# EAGLE design pcb_adc (EAGLE 7.4.0)
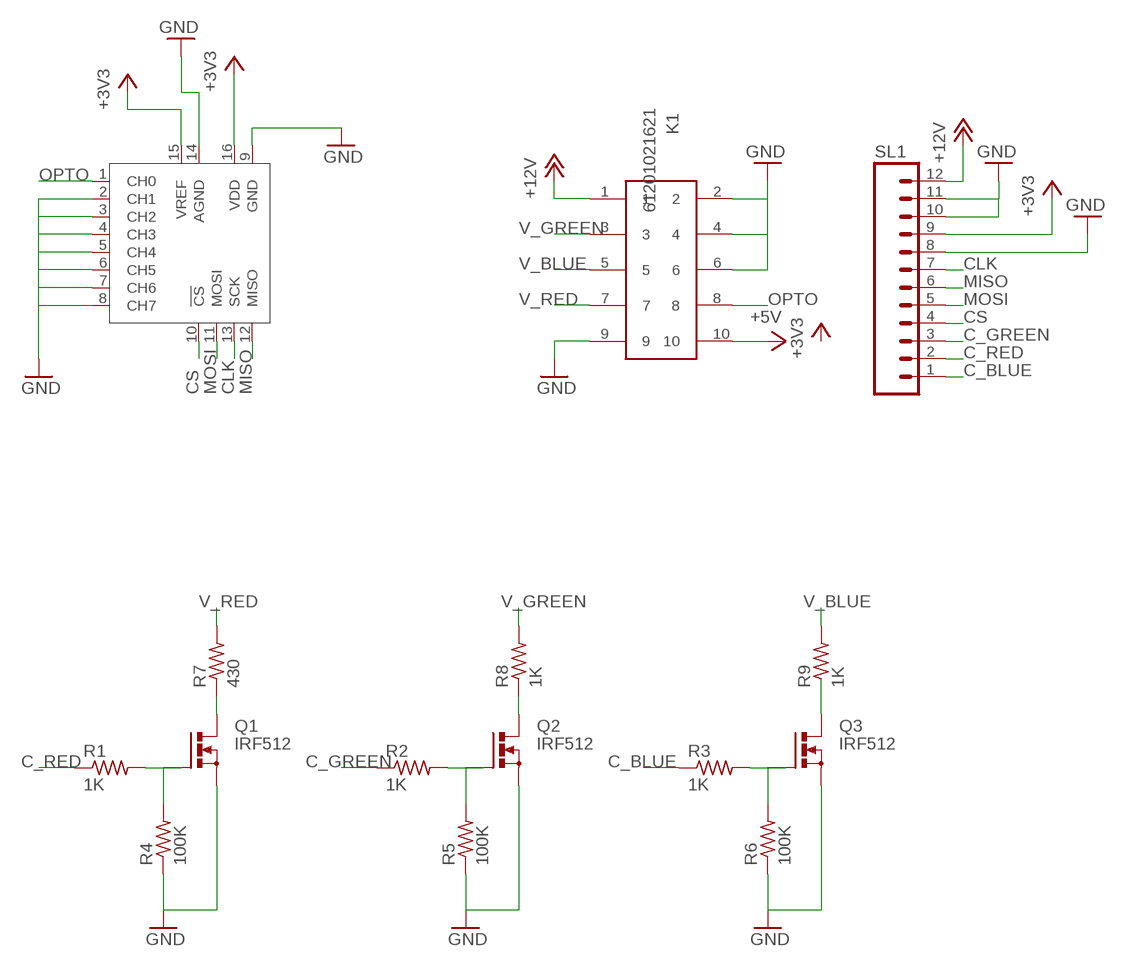
[diagram p0: schematic, sheet 1]

## Parts
K1  61201021621  [61201021621]
Q1  IRF512  [TO220BV]
Q2  IRF512  [TO220BV]
Q3  IRF512  [TO220BV]
R1  1K  R-US_0204/7  [0204/7]
R2  1K  R-US_0204/7  [0204/7]
R3  1K  R-US_0204/7  [0204/7]
R4  100K  R-US_0204/7  [0204/7]
R5  100K  R-US_0204/7  [0204/7]
R6  100K  R-US_0204/7  [0204/7]
R7  430  R-US_0204/7  [0204/7]
R8  1K  R-US_0204/7  [0204/7]
R9  1K  R-US_0204/7  [0204/7]
SL1  M12  [12P]
U$1  MCP3008P  [DIL16]

## Nets
+3V3: SL1.9 U$1.15(VREF) U$1.16(VDD)
+5V: K1.10
+12V: K1.1 SL1.12
C_BLUE: R3.1 SL1.1
C_GREEN: R2.1 SL1.3
C_RED: R1.1 SL1.2
CLK: SL1.7 U$1.13(SCK)
CS: SL1.4 U$1.10(!CS)
GND: K1.2 K1.4 K1.6 K1.9 Q1.S Q2.S Q3.S R4.1 R5.1 R6.1 SL1.8 SL1.10 SL1.11 U$1.2(CH1) U$1.3(CH2) U$1.4(CH3) U$1.5(CH4) U$1.6(CH5) U$1.7(CH6) U$1.8(CH7) U$1.9(GND) U$1.14(AGND)
MISO: SL1.6 U$1.12(MISO)
MOSI: SL1.5 U$1.11(MOSI)
N$1: Q1.G R1.2 R4.2
N$2: Q2.G R2.2 R5.2
N$3: Q3.G R3.2 R6.2
N$4: Q1.D R7.1
N$5: Q2.D R8.1
N$8: Q3.D R9.1
OPTO: K1.8 U$1.1(CH0)
V_BLUE: K1.5 R9.2
V_GREEN: K1.3 R8.2
V_RED: K1.7 R7.2

## Library data of the parts
K1 = Wurth_Elektronik_Electromechanic_Wire_to_Board_Connectors_rev15c:61201021621: WR-BHD 2.54mm Male Box Header, 10 Pins=>Code : Con_WTB_BHD_2.54_Male_THT_WS_61201021621 <http://katalog.we-online.de/media/thumbs2/eican/thb_Con_WTB_BHD_2.54_Male_THT_WS_6120xx21621_pf2.jpg> Details see: http://katalog.we-online.de/en/em/612_0xx_216_21 Created 2014-06-04, Karrer Zheng 2014 (C) Würth Elektronik
Q1-Q3 = transistor-power:IRF512: N-CHANNEL MOS FET
R1-R9 = resistor:R-US_: RESISTOR, American symbol
SL1 = con-amp-quick:M12: AMP QUICK CONNECTOR; OC_FARNELL: unknown; OC_NEWARK: unknown
U$1 = MCP3008:MCP3008

## Board
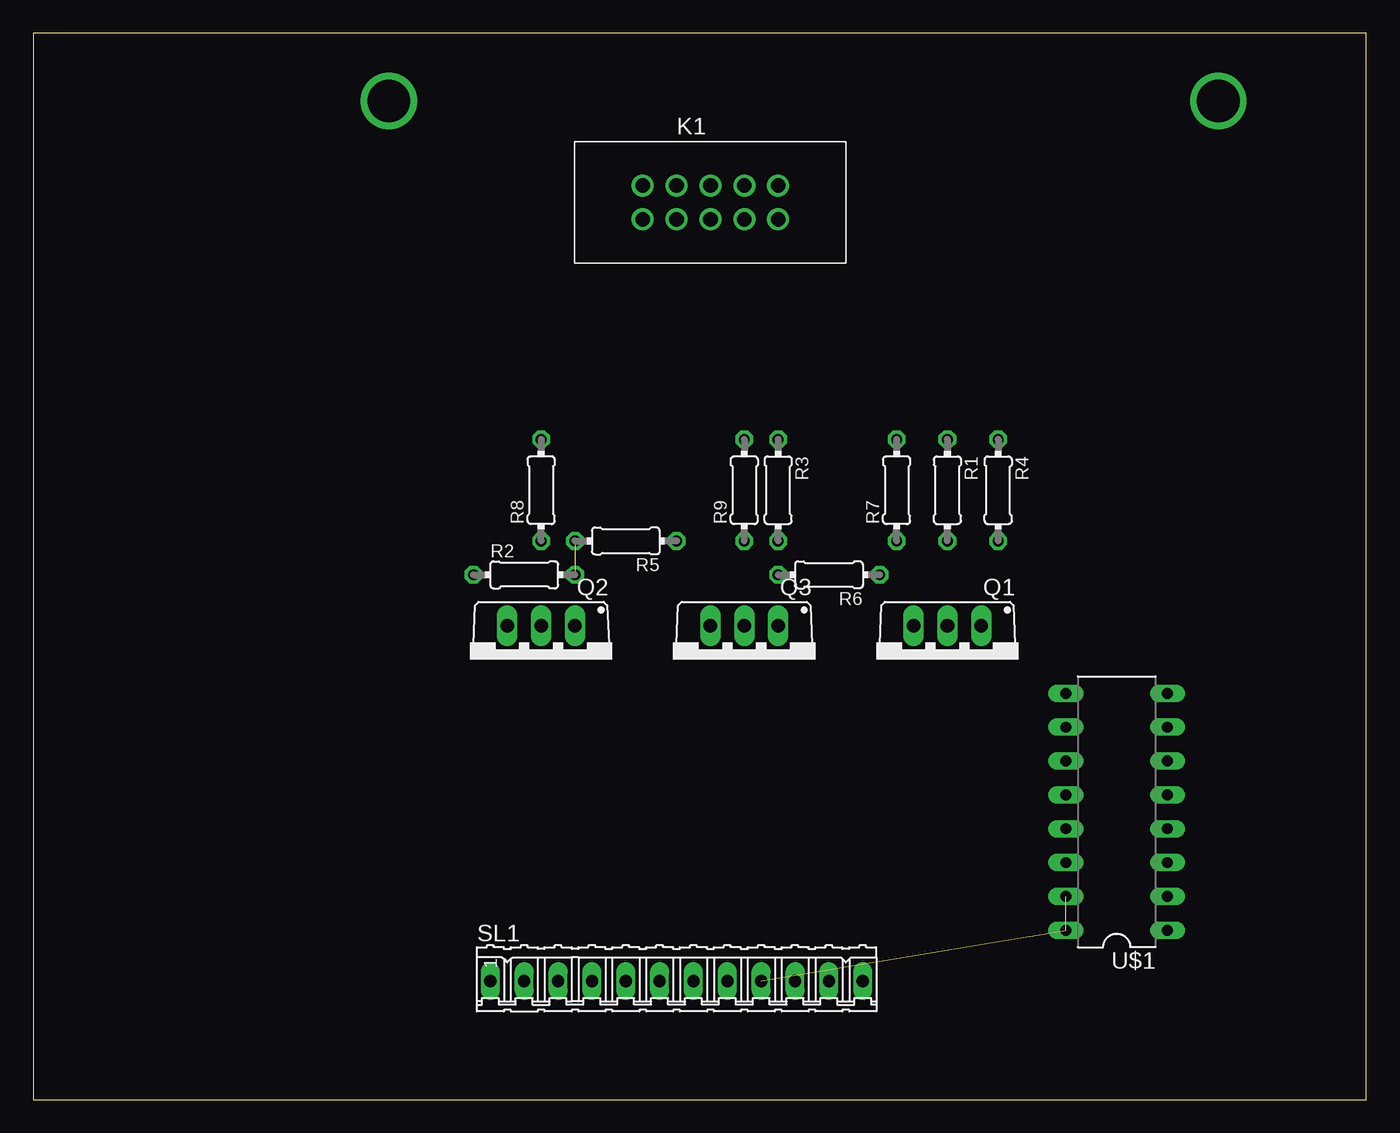
[diagram p1: board, top side]
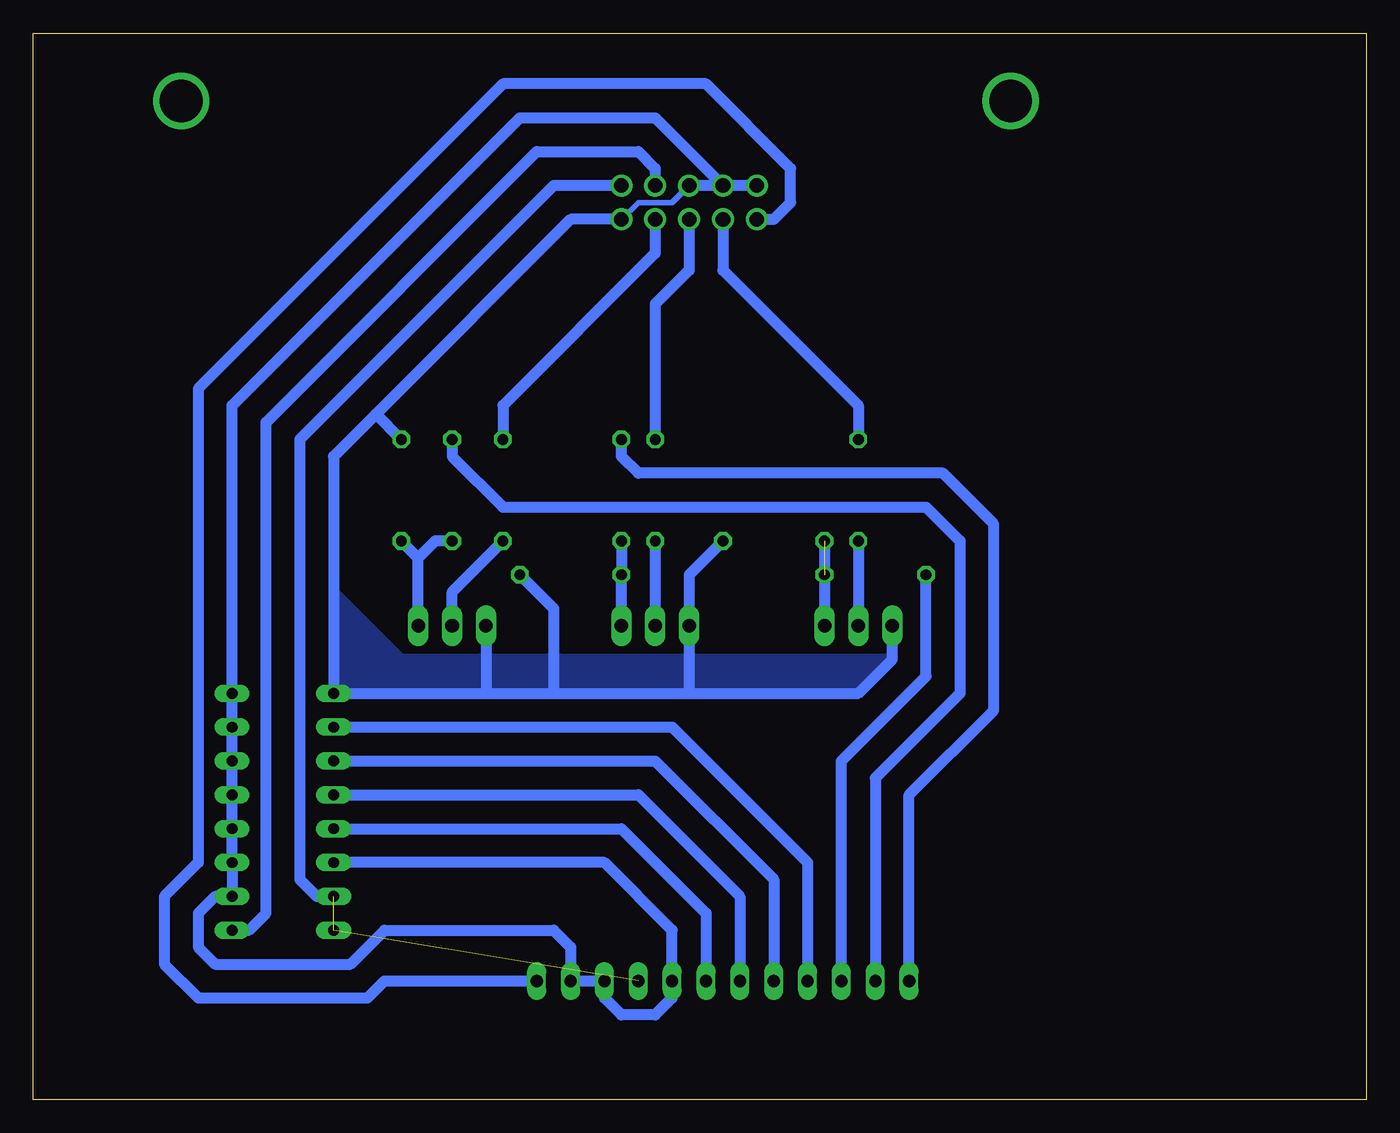
[diagram p2: board, bottom side, seen from below]

Size 100 x 80 mm. Coordinates in mm from the lower left corner, seen from the top.
Outline: 0,0 100,0 100,80 0,80 0,0
Copper layers (1*16): Top 0.035mm / dielectric 1.5mm / Bottom 0.035mm
Design rules "default": minimum track width 10mil, minimum drill 24mil, track to track 8mil, track to pad 8mil, pad to pad 8mil, via to via 8mil, smd to smd 8mil, copper to edge 40mil, drill to drill 8mil, minimum pad ring 10mil, minimum via ring 8mil, stop-mask expansion 4mil, vias tented up to drill 0mil, thermal gap 10mil

### Footprints (pad centres in the part's own frame; a part is rotated, then mirrored left to right if it is on the bottom)
61201021621 = drill 1.1: 1 -2.54,-1.27; 2 -2.54,1.27; 3 0,-1.27; 4 0,1.27; 5 2.54,-1.27; 6 2.54,1.27; 7 5.08,-1.27; 8 5.08,1.27; 9 7.62,-1.27; 10 7.62,1.27
TO220BV = drill 1.016 long: D 0,-2.54; G -2.54,-2.54; S 2.54,-2.54
0204/7 = drill 0.813 octagon: 1 -3.81,0; 2 3.81,0
12P = drill 0.914 long: 1 -13.97,0; 2 -11.43,0; 3 -8.89,0; 4 -6.35,0; 5 -3.81,0; 6 -1.27,0; 7 1.27,0; 8 3.81,0; 9 6.35,0; 10 8.89,0; 11 11.43,0; 12 13.97,0
DIL16 = drill 0.813 long: 1 -8.89,-3.81; 2 -6.35,-3.81; 3 -3.81,-3.81; 4 -1.27,-3.81; 5 1.27,-3.81; 6 3.81,-3.81; 7 6.35,-3.81; 8 8.89,-3.81; 9 8.89,3.81; 10 6.35,3.81; 11 3.81,3.81; 12 1.27,3.81; 13 -1.27,3.81; 14 -3.81,3.81; 15 -6.35,3.81; 16 -8.89,3.81

### Placement (x,y rotation side)
K1  48.26,67.31 0 top
Q1  68.58,33.02 180 top
Q2  38.1,33.02 180 top
Q3  53.34,33.02 180 top
R1  68.58,45.72 270 top
R2  36.83,39.37 0 top
R3  55.88,45.72 270 top
R4  72.39,45.72 270 top
R5  44.45,41.91 180 top
R6  59.69,39.37 180 top
R7  64.77,45.72 90 top
R8  38.1,45.72 90 top
R9  53.34,45.72 90 top
SL1  48.26,8.89 0 top
U$1  81.28,21.59 90 top

### Tracks (layer width: path | path; a pad name or v marks a point on that pad's centre or on a via)
+3V3  (2 unrouted)
+5V
  Bottom 0.813: K1.10 60.96,68.58 80.01,49.53 80.01,16.51 78.74,15.24
+12V
  Bottom 0.813: K1.1 44.45,66.04 43.18,67.31 43.18,69.85 49.53,76.2 64.77,76.2 87.63,53.34 87.63,17.78 90.17,15.24 90.17,10.16 87.63,7.62 74.93,7.62 73.66,8.89 SL1.12
C_BLUE
  Bottom 0.813: SL1.1 34.29,22.86 27.94,29.21 27.94,43.18 31.75,46.99 54.61,46.99 55.88,48.26 R3.1
C_GREEN
  Bottom 0.813: SL1.3 39.37,25.4 33.02,31.75 R2.1
C_RED
  Bottom 0.813: SL1.2 36.83,24.13 30.48,30.48 30.48,41.91 33.02,44.45 64.77,44.45 68.58,48.26 R1.1
CLK
  Bottom 0.813: U$1.13 55.88,20.32 49.53,13.97 SL1.7
CS
  Bottom 0.813: U$1.10 52.07,27.94 41.91,17.78 SL1.4
GND
  Bottom 0.254: 59.66,8.91 SL1.11
  Bottom 0.406: K1.6 52.07,67.31 54.61,67.31 K1.9
  Bottom 0.813: K1.2 K1.4 | K1.4 K1.6 | 59.66,8.91 59.64,8.89 SL1.10 57.15,7.62 55.88,6.35 53.34,6.35 52.07,7.62 SL1.8 52.07,12.7 57.15,17.78 U$1.14 | SL1.11 59.69,11.43 60.96,12.7 73.66,12.7 76.2,10.16 86.36,10.16 87.63,11.43 87.63,13.97 86.36,15.24 U$1.2 U$1.3 U$1.4 U$1.5 U$1.6 U$1.7 U$1.8 85.09,52.07 63.5,73.66 53.34,73.66 K1.4 | 66.04,30.48 U$1.9 77.47,48.26 74.3,51.44 | 66.04,30.48 60.96,30.48 | 60.96,30.48 50.8,30.48 | 50.8,30.48 38.1,30.48 35.56,33.02 Q2.S | 50.8,30.48 Q3.S 50.8,39.37 R5.1 | Q1.S 66.04,30.48 | K1.9 59.69,66.04 74.3,51.44 | R6.1 60.96,36.83 60.96,30.48 | R4.1 74.3,51.44
  pour Bottom (no thermals): 35.56,33.02 72.39,33.02 77.47,38.1 77.47,30.48 38.1,30.48
MISO
  Bottom 0.813: U$1.12 54.61,22.86 46.99,15.24 SL1.6
MOSI
  Bottom 0.813: U$1.11 53.34,25.4 44.45,16.51 SL1.5
N$1
  Bottom 0.813: Q1.G 71.12,40.64 | 71.12,40.64 R4.2 | R1.2 69.85,41.91 71.12,40.64
N$2  (1 unrouted)
  Bottom 0.813: R5.2 Q2.G
N$3
  Bottom 0.813: Q3.G R6.2 R3.2
N$4
  Bottom 0.813: Q1.D 68.58,38.1 R7.1
N$5
  Bottom 0.813: R8.1 Q2.D
N$6  (via drill 3.2)
  other vias: 26.67,74.93
N$7  (via drill 3.2)
  other vias: 88.9,74.93
N$8
  Bottom 0.813: R9.1 Q3.D
OPTO
  Bottom 0.813: U$1.1 83.82,12.7 82.55,13.97 82.55,50.8 62.23,71.12 54.61,71.12 53.34,69.85 K1.8
V_BLUE
  Bottom 0.813: K1.5 50.8,62.23 53.34,59.69 R9.2
V_GREEN
  Bottom 0.813: K1.3 48.26,62.23 38.1,52.07 R8.2
V_RED
  Bottom 0.813: K1.7 53.34,63.5 64.77,52.07 R7.2